# Altium schematic sheet VolumeControl.SchDoc
size A4; SheetNumber: 3; SheetTotal: 3
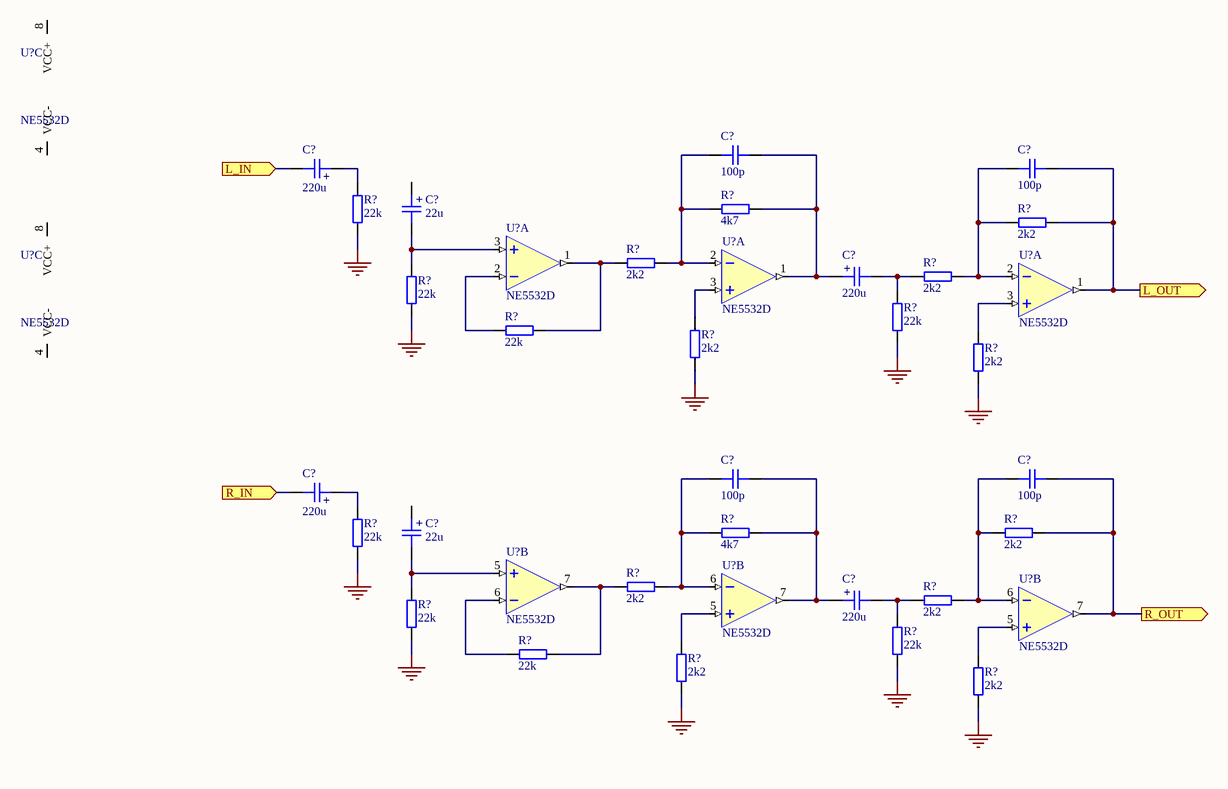
[diagram p0: VolumeControl.SchDoc]

## Parts
(Parts that share a designator on the sheet are numbered #1, #2 ... from top to bottom, then left to right.)
C?#1  100p  [CAP_0603]
C?#2  220u  [CAP_AE_SMD_D6MM3_H5M55]
C?#3  100p  [CAP_0603]
C?#4  22u  [CAP_AE_SMD_D6MM3_H5M55]
C?#5  220u  [CAP_AE_SMD_D6MM3_H5M55]
C?#6  100p  [CAP_0603]
C?#7  100p  [CAP_0603]
C?#8  220u  [CAP_AE_SMD_D6MM3_H5M55]
C?#9  22u  [CAP_AE_SMD_D6MM3_H5M55]
C?#10  220u  [CAP_AE_SMD_D6MM3_H5M55]
R?#1  22k  [RES_0603]
R?#2  4k7  [RES_0603]
R?#3  2k2  [RES_0603]
R?#4  2k2  [RES_0603]
R?#5  2k2  [RES_0603]
R?#6  22k  [RES_0603]
R?#7  22k  [RES_0603]
R?#8  22k  [RES_0603]
R?#9  2k2  [RES_0603]
R?#10  2k2  [RES_0603]
R?#11  22k  [RES_0603]
R?#12  4k7  [RES_0603]
R?#13  2k2  [RES_0603]
R?#14  2k2  [RES_0603]
R?#15  2k2  [RES_0603]
R?#16  22k  [RES_0603]
R?#17  22k  [RES_0603]
R?#18  22k  [RES_0603]
R?#19  2k2  [RES_0603]
R?#20  2k2  [RES_0603]
U?#1  NE5532D  [SOIC-8]  (part C of 3)
U?#2  NE5532D  [SOIC-8]  (part A of 3)
U?#3  NE5532D  [SOIC-8]  (part A of 3)
U?#4  NE5532D  [SOIC-8]  (part C of 3)
U?#5  NE5532D  [SOIC-8]  (part A of 3)
U?#6  NE5532D  [SOIC-8]  (part B of 3)
U?#7  NE5532D  [SOIC-8]  (part B of 3)
U?#8  NE5532D  [SOIC-8]  (part B of 3)

## Ports
L_IN (in), L_OUT (out), R_IN (in), R_OUT (out)

## Nets
GND: R?#1.1 R?#6.1 R?#7.1 R?#9.1 R?#10.2 R?#11.1 R?#16.1 R?#17.1 R?#19.1 R?#20.1
L_IN: C?#2.2 ; port L_IN
L_OUT: C?#3.2 R?#3.1 U?#5.1(1OUT) ; port L_OUT
R_IN: C?#8.2 ; port R_IN
R_OUT: C?#7.2 R?#13.1 U?#8.7(2OUT) ; port R_OUT
NetC?#1_1: C?#1.1 R?#2.1 R?#4.1 U?#3.2(1IN-)
NetC?#1_2: C?#1.2 C?#5.1 R?#2.2 U?#3.1(1OUT)
NetC?#2_1: C?#2.1 R?#1.2
NetC?#3_1: C?#3.1 R?#3.2 R?#5.1 U?#5.2(1IN-)
NetC?#4_2: C?#4.2 R?#6.2 U?#2.3(1IN+)
NetC?#5_2: C?#5.2 R?#5.2 R?#7.2
NetC?#6_1: C?#6.1 R?#12.1 R?#14.1 U?#7.6(2IN-)
NetC?#6_2: C?#6.2 C?#10.1 R?#12.2 U?#7.7(2OUT)
NetC?#7_1: C?#7.1 R?#13.2 R?#15.1 U?#8.6(2IN-)
NetC?#8_1: C?#8.1 R?#11.2
NetC?#9_2: C?#9.2 R?#16.2 U?#6.5(2IN+)
NetC?#10_2: C?#10.2 R?#15.2 R?#17.2
NetR?#4_2: R?#4.2 R?#8.1 U?#2.1(1OUT)
NetR?#8_2: R?#8.2 U?#2.2(1IN-)
NetR?#9_2: R?#9.2 U?#3.3(1IN+)
NetR?#10_1: R?#10.1 U?#5.3(1IN+)
NetR?#14_2: R?#14.2 R?#18.1 U?#6.7(2OUT)
NetR?#18_2: R?#18.2 U?#6.6(2IN-)
NetR?#19_2: R?#19.2 U?#7.5(2IN+)
NetR?#20_2: R?#20.2 U?#8.5(2IN+)

Not connected (* = marked no-connect by the designer): C?#4 1; C?#9 1; U?#1 4(VCC-) 8(VCC+); U?#4 4(VCC-) 8(VCC+)

## Notes on the sheet
- (in symbol CAP_ALEL_6.3x5.5) +

## Library data of the parts
C?#1 C?#3 C?#6 C?#7 = CAP_0603: Capacitor SMD 0603; Manufacturer: *; Manufacturer Part Number: *; Distributor Link: *; LCSC: *; Rating: *; Dielectric: *
C?#2 C?#4 C?#5 C?#8-C?#10 = CAP_ALEL_6.3x5.5: Capacitor SMD Aluminium Electrolytic 6.3mm Diameter 5.5mm Height; Manufacturer: *; Manufacturer Part Number: *; Distributor Link: *; LCSC: *
R?#1-R?#20 = RES_0603: Resistor SMD 0603; Manufacturer: *; Manufacturer Part Number: *; Distributor Link: *; LCSC: *
U?#1-U?#8 = NE5532D: Dual Low-Noise Operational Amplifiers; Manufacturer: Texas Instruments; Manufacturer Part Number: NE5532D